# Altium schematic sheet MainBoard.SchDoc
size A2; SheetNumber: 2; SheetTotal: 7
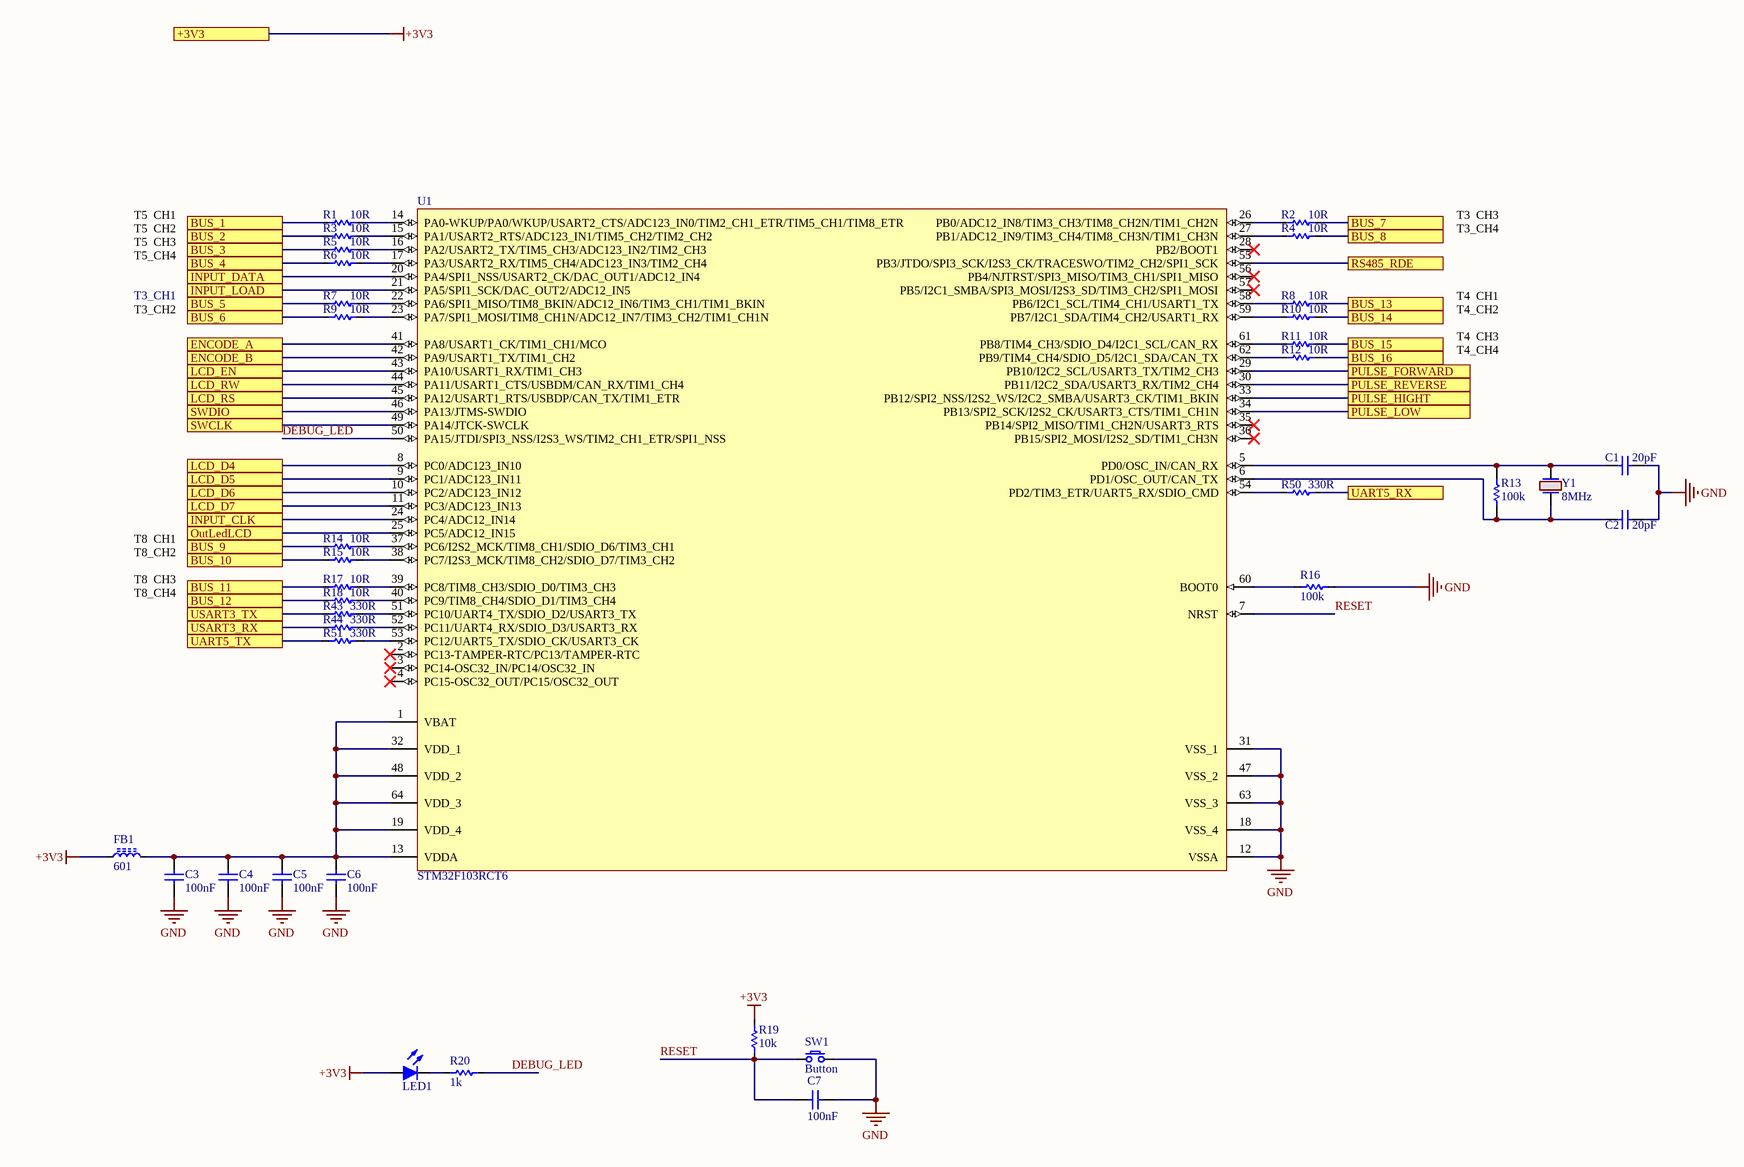
[diagram p0: MainBoard.SchDoc]

## Parts
C1  20pF  [C 0603 (1608)]
C2  20pF  [C 0603 (1608)]
C3  100nF  [C 0805 (2012)]
C4  100nF  [C 0805 (2012)]
C5  100nF  [C 0805 (2012)]
C6  100nF  [C 0805 (2012)]
C7  100nF  [C 0805 (2012)]
FB1  601  [Inductor SMD 0805 (2012)]
LED1  Led  [Led SMD 0603]  (value not drawn)
R1  10R  [R 0603 (1608)]
R2  10R  [R 0603 (1608)]
R3  10R  [R 0603 (1608)]
R4  10R  [R 0603 (1608)]
R5  10R  [R 0603 (1608)]
R6  10R  [R 0603 (1608)]
R7  10R  [R 0603 (1608)]
R8  10R  [R 0603 (1608)]
R9  10R  [R 0603 (1608)]
R10  10R  [R 0603 (1608)]
R11  10R  [R 0603 (1608)]
R12  10R  [R 0603 (1608)]
R13  100k  [R 0603 (1608)]
R14  10R  [R 0603 (1608)]
R15  10R  [R 0603 (1608)]
R16  100k  [R 0603 (1608)]
R17  10R  [R 0603 (1608)]
R18  10R  [R 0603 (1608)]
R19  10k  [R 0805 (2012)]
R20  1k  [R 0603 (1608)]
R43  330R  [R 0603 (1608)]
R44  330R  [R 0603 (1608)]
R50  330R  [R 0603 (1608)]
R51  330R  [R 0603 (1608)]
SW1  Button  [SW/2/SMD]
U1  STM32F103RCT6  [LQFP64_N]
Y1  8MHz  [Crystal SMD FC135]

## Ports
+3V3, BUS_1, BUS_2, BUS_3, BUS_4, BUS_5, BUS_6, BUS_7, BUS_8, BUS_9, BUS_10, BUS_11, BUS_12, BUS_13, BUS_14, BUS_15, BUS_16, ENCODE_A, ENCODE_B, INPUT_CLK, INPUT_DATA, INPUT_LOAD, LCD_D4, LCD_D5, LCD_D6, LCD_D7, LCD_EN, LCD_RS, LCD_RW, OutLedLCD, PULSE_FORWARD, PULSE_HIGHT, PULSE_LOW, PULSE_REVERSE, RS485_RDE, SWCLK, SWDIO, UART5_RX, UART5_TX, USART3_RX, USART3_TX

## Nets
+3V3: FB1.1 LED1.2(A) R19.2 ; port +3V3
GND: C1.2 C2.2 C3.2 C4.2 C5.2 C6.2 C7.2 R16.2 SW1.2 U1.12(VSSA) U1.18(VSS_4) U1.31(VSS_1) U1.47(VSS_2) U1.63(VSS_3)
BUS_1: R1.1 ; port BUS_1
BUS_2: R3.1 ; port BUS_2
BUS_3: R5.1 ; port BUS_3
BUS_4: R6.1 ; port BUS_4
BUS_5: R7.1 ; port BUS_5
BUS_6: R9.1 ; port BUS_6
BUS_7: R2.2 ; port BUS_7
BUS_8: R4.2 ; port BUS_8
BUS_9: R14.1 ; port BUS_9
BUS_10: R15.1 ; port BUS_10
BUS_11: R17.1 ; port BUS_11
BUS_12: R18.1 ; port BUS_12
BUS_13: R8.2 ; port BUS_13
BUS_14: R10.2 ; port BUS_14
BUS_15: R11.2 ; port BUS_15
BUS_16: R12.2 ; port BUS_16
DEBUG_LED: R20.2 U1.50(PA15/JTDI/SPI3_NSS/I2S3_WS/TIM2_CH1_ETR/SPI1_NSS)
ENCODE_A: U1.41(PA8/USART1_CK/TIM1_CH1/MCO) ; port ENCODE_A
ENCODE_B: U1.42(PA9/USART1_TX/TIM1_CH2) ; port ENCODE_B
INPUT_CLK: U1.24(PC4/ADC12_IN14) ; port INPUT_CLK
INPUT_DATA: U1.20(PA4/SPI1_NSS/USART2_CK/DAC_OUT1/ADC12_IN4) ; port INPUT_DATA
INPUT_LOAD: U1.21(PA5/SPI1_SCK/DAC_OUT2/ADC12_IN5) ; port INPUT_LOAD
LCD_D4: U1.8(PC0/ADC123_IN10) ; port LCD_D4
LCD_D5: U1.9(PC1/ADC123_IN11) ; port LCD_D5
LCD_D6: U1.10(PC2/ADC123_IN12) ; port LCD_D6
LCD_D7: U1.11(PC3/ADC123_IN13) ; port LCD_D7
LCD_EN: U1.43(PA10/USART1_RX/TIM1_CH3) ; port LCD_EN
LCD_RS: U1.45(PA12/USART1_RTS/USBDP/CAN_TX/TIM1_ETR) ; port LCD_RS
LCD_RW: U1.44(PA11/USART1_CTS/USBDM/CAN_RX/TIM1_CH4) ; port LCD_RW
OutLedLCD: U1.25(PC5/ADC12_IN15) ; port OutLedLCD
PULSE_FORWARD: U1.29(PB10/I2C2_SCL/USART3_TX/TIM2_CH3) ; port PULSE_FORWARD
PULSE_HIGHT: U1.33(PB12/SPI2_NSS/I2S2_WS/I2C2_SMBA/USART3_CK/TIM1_BKIN) ; port PULSE_HIGHT
PULSE_LOW: U1.34(PB13/SPI2_SCK/I2S2_CK/USART3_CTS/TIM1_CH1N) ; port PULSE_LOW
PULSE_REVERSE: U1.30(PB11/I2C2_SDA/USART3_RX/TIM2_CH4) ; port PULSE_REVERSE
RESET: C7.1 R19.1 SW1.1 U1.7(NRST)
RS485_RDE: U1.55(PB3/JTDO/SPI3_SCK/I2S3_CK/TRACESWO/TIM2_CH2/SPI1_SCK) ; port RS485_RDE
SWCLK: U1.49(PA14/JTCK-SWCLK) ; port SWCLK
SWDIO: U1.46(PA13/JTMS-SWDIO) ; port SWDIO
UART5_RX: R50.2 ; port UART5_RX
UART5_TX: R51.1 ; port UART5_TX
USART3_RX: R44.1 ; port USART3_RX
USART3_TX: R43.1 ; port USART3_TX
NetC1_1: C1.1 R13.2 U1.5(PD0/OSC_IN/CAN_RX) Y1.2
NetC2_1: C2.1 R13.1 U1.6(PD1/OSC_OUT/CAN_TX) Y1.1
NetC3_1: C3.1 C4.1 C5.1 C6.1 FB1.2 U1.1(VBAT) U1.13(VDDA) U1.19(VDD_4) U1.32(VDD_1) U1.48(VDD_2) U1.64(VDD_3)
NetLED1_1: LED1.1(K) R20.1
NetR1_2: R1.2 U1.14(PA0-WKUP/PA0/WKUP/USART2_CTS/ADC123_IN0/TIM2_CH1_ETR/TIM5_CH1/TIM8_ETR)
NetR2_1: R2.1 U1.26(PB0/ADC12_IN8/TIM3_CH3/TIM8_CH2N/TIM1_CH2N)
NetR3_2: R3.2 U1.15(PA1/USART2_RTS/ADC123_IN1/TIM5_CH2/TIM2_CH2)
NetR4_1: R4.1 U1.27(PB1/ADC12_IN9/TIM3_CH4/TIM8_CH3N/TIM1_CH3N)
NetR5_2: R5.2 U1.16(PA2/USART2_TX/TIM5_CH3/ADC123_IN2/TIM2_CH3)
NetR6_2: R6.2 U1.17(PA3/USART2_RX/TIM5_CH4/ADC123_IN3/TIM2_CH4)
NetR7_2: R7.2 U1.22(PA6/SPI1_MISO/TIM8_BKIN/ADC12_IN6/TIM3_CH1/TIM1_BKIN)
NetR8_1: R8.1 U1.58(PB6/I2C1_SCL/TIM4_CH1/USART1_TX)
NetR9_2: R9.2 U1.23(PA7/SPI1_MOSI/TIM8_CH1N/ADC12_IN7/TIM3_CH2/TIM1_CH1N)
NetR10_1: R10.1 U1.59(PB7/I2C1_SDA/TIM4_CH2/USART1_RX)
NetR11_1: R11.1 U1.61(PB8/TIM4_CH3/SDIO_D4/I2C1_SCL/CAN_RX)
NetR12_1: R12.1 U1.62(PB9/TIM4_CH4/SDIO_D5/I2C1_SDA/CAN_TX)
NetR14_2: R14.2 U1.37(PC6/I2S2_MCK/TIM8_CH1/SDIO_D6/TIM3_CH1)
NetR15_2: R15.2 U1.38(PC7/I2S3_MCK/TIM8_CH2/SDIO_D7/TIM3_CH2)
NetR16_1: R16.1 U1.60(BOOT0)
NetR17_2: R17.2 U1.39(PC8/TIM8_CH3/SDIO_D0/TIM3_CH3)
NetR18_2: R18.2 U1.40(PC9/TIM8_CH4/SDIO_D1/TIM3_CH4)
NetR43_2: R43.2 U1.51(PC10/UART4_TX/SDIO_D2/USART3_TX)
NetR44_2: R44.2 U1.52(PC11/UART4_RX/SDIO_D3/USART3_RX)
NetR50_1: R50.1 U1.54(PD2/TIM3_ETR/UART5_RX/SDIO_CMD)
NetR51_2: R51.2 U1.53(PC12/UART5_TX/SDIO_CK/USART3_CK)

Not connected (* = marked no-connect by the designer): U1 2(PC13-TAMPER-RTC/PC13/TAMPER-RTC)* 3(PC14-OSC32_IN/PC14/OSC32_IN)* 4(PC15-OSC32_OUT/PC15/OSC32_OUT)* 28(PB2/BOOT1)* 35(PB14/SPI2_MISO/TIM1_CH2N/USART3_RTS)* 36(PB15/SPI2_MOSI/I2S2_SD/TIM1_CH3N)* 56(PB4/NJTRST/SPI3_MISO/TIM3_CH1/SPI1_MISO)* 57(PB5/I2C1_SMBA/SPI3_MOSI/I2S3_SD/TIM3_CH2/SPI1_MOSI)*

## Notes on the sheet
- T5_CH1
- T5_CH2
- T5_CH3
- T5_CH4
- T3_CH3
- T3_CH4
- T3_CH1
- T3_CH2
- T4_CH1
- T4_CH2
- T4_CH3
- T4_CH4
- T8_CH1
- T8_CH3
- T8_CH4
- T8_CH2

## Library data of the parts
C1-C7 = Capacitor NP: Capacitor non-pol
FB1 = Ferrite Breab
LED1 = Led: Typical LED
R1-R20 R43 R44 R50 R51 = Resistor: Published: 8-Jun-2000; LatestRevisionDate: 17-Jul-2002; LatestRevisionNote: Re-released for DXP Platform.; PackageReference: AXIAL-0.3; Publisher: Altium Limited
SW1 = SW SPST: Tact switch 2 pin
U1 = STM32F103RCT6: ARM Cortex-M3 32-bit MCU, 256 KB Flash, 48 KB Internal RAM, 51 I/Os, 64-pin LQFP, -40 to 85 degC, Tray; A/D Converter: 3x12-bit (16 Channel); D/A Converter: 2x12-bit (2 Channel); FLASH Size (Prog) (kB): 256; I/Os (High Current): 51; Internal RAM Size (kB): 48; Operating Frequency(F) (Processor speed) (MHz): 72; Supply Voltage(Vcc) min (V): 2; DatasheetVersion: Rev. 8; PackageVersion: Rev. 4, 06/2013; PackageReference: LQFP64; PackageDescription: 64-Pin Low Profile Quad Flat Package, 10 x 10 mm Body, 0.5 mm Pitch; Supplier 1: Digi-Key; Supplier Part Number 1: 497-9033-ND; Supplier 2: Newark; Supplier Part Number 2: 01P4099; Supplier 3: Newark; Supplier Part Number 3: 57P1227; Supplier 4: Mouser; Supplier Part Number 4: 511-STM32F103RCT6; Core: ARM Cortex-M3; Packing: Tray; Mounting Technology: Surface Mount; PartNumber: STM32F103RCT6; ComponentLink1Description: Manufacturer URL; ComponentLink1URL: http://www.st.com/web/en/home.html; ComponentLink2Description: Datasheet; ComponentLink2URL: http://www.st.com/st-web-ui/static/active/en/resource/technical/document/datasheet/CD00191185.pdf; ComponentLink3Description: Package Specification; ComponentLink3URL: http://www.st.com/st-web-ui/static/active/en/resource/technical/document/datasheet/DM00037051.pdf
Y1 = Crystal